# Altium schematic sheet Power.SchDoc
size C
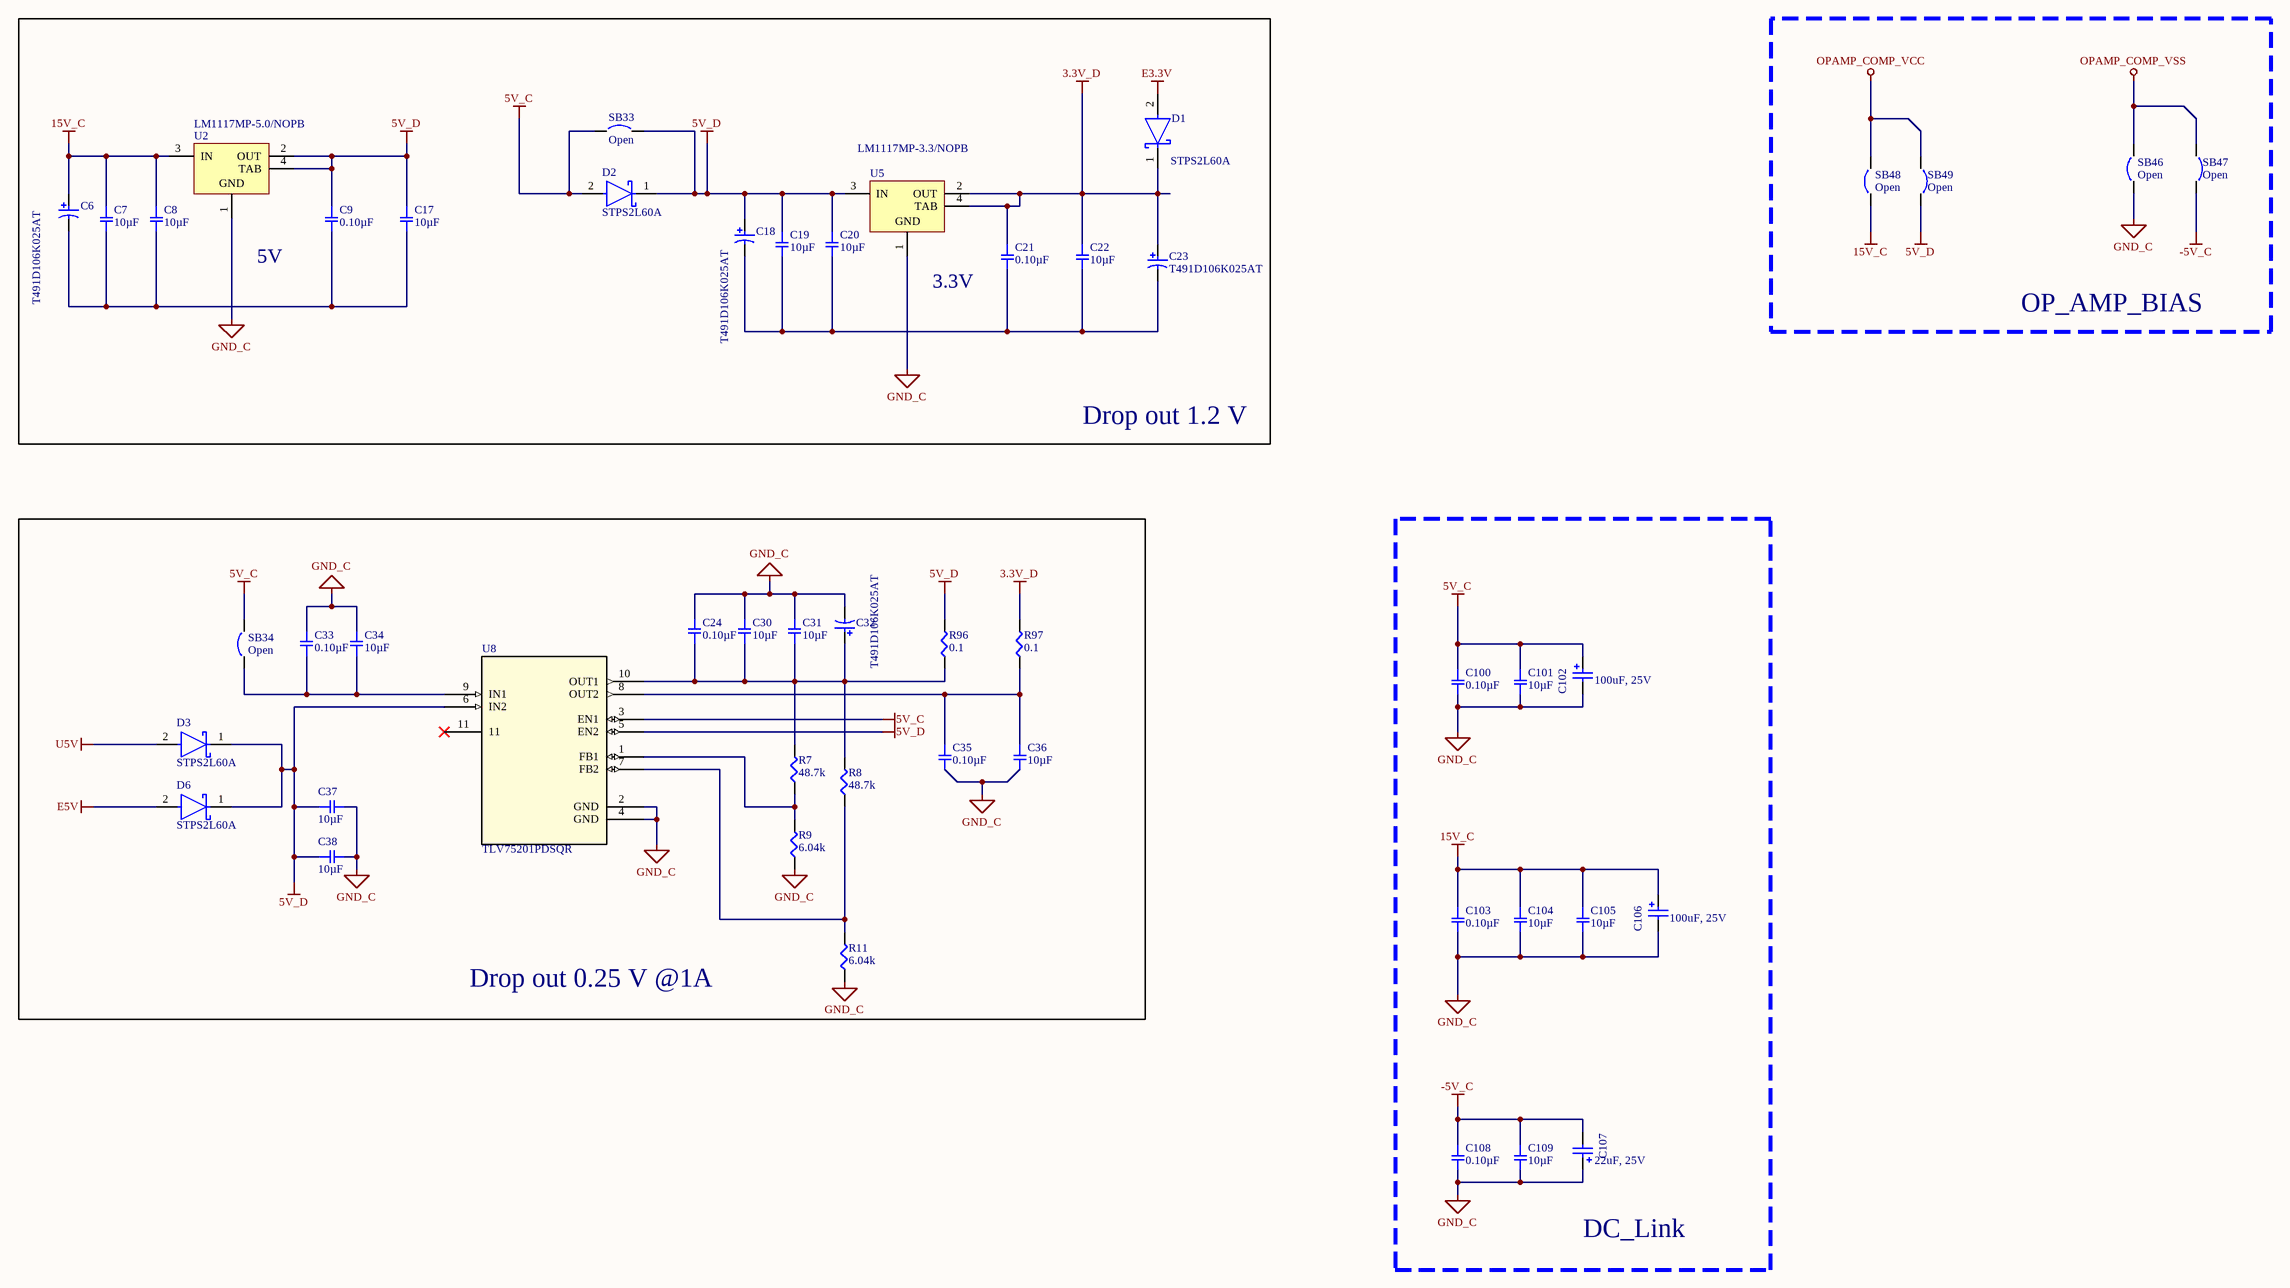
[diagram p0: Power.SchDoc]

## Parts
C6  T491D106K025AT  [KEMT-T491-D_L]
C7  10µF  [SMD-0805C]
C8  10µF  [SMD-0805C]
C9  0.10µF  [SMD-0805C]
C17  10µF  [SMD-0805C]
C18  T491D106K025AT  [KEMT-T491-D_L]
C19  10µF  [SMD-0805C]
C20  10µF  [SMD-0805C]
C21  0.10µF  [SMD-0805C]
C22  10µF  [SMD-0805C]
C23  T491D106K025AT  [KEMT-T491-D_L]
C24  0.10µF  [SMD-0805C]
C30  10µF  [SMD-0805C]
C31  10µF  [SMD-0805C]
C32  T491D106K025AT  [KEMT-T491-D_L]
C33  0.10µF  [SMD-0805C]
C34  10µF  [SMD-0805C]
C35  0.10µF  [SMD-0805C]
C36  10µF  [SMD-0805C]
C37  10µF  [SMD-0805C]
C38  10µF  [SMD-0805C]
C100  0.10µF  [SMD-0805C]
C101  10µF  [SMD-0805C]
C102  100uF, 25V  [WCAP-ASLU_6.3x7.7]
C103  0.10µF  [SMD-0805C]
C104  10µF  [SMD-0805C]
C105  10µF  [SMD-0805C]
C106  100uF, 25V  [WCAP-ASLU_6.3x7.7]
C107  22uF, 25V  [WCAP-ASLU_5x5.5]
C108  0.10µF  [SMD-0805C]
C109  10µF  [SMD-0805C]
D1  STPS2L60A  [FP-SMA-MFG]
D2  STPS2L60A  [FP-SMA-MFG]
D3  STPS2L60A  [FP-SMA-MFG]
D6  STPS2L60A  [FP-SMA-MFG]
R7  48.7k  [SMD-0603-RES]
R8  48.7k  [SMD-0603-RES]
R9  6.04k  [SMD-0603-RES]
R11  6.04k  [SMD-0603-RES]
R96  0.1  [SMD-1206-RES]
R97  0.1  [SMD-1206-RES]
SB33  Open  [SB_0603]  (no BOM)
SB34  Open  [SB_0603]  (no BOM)
SB46  Open  [Solder Bridge - HP]  (no BOM)
SB47  Open  [Solder Bridge - HP]  (no BOM)
SB48  Open  [Solder Bridge - HP]  (no BOM)
SB49  Open  [Solder Bridge - HP]  (no BOM)
U2  LM1117MP-5.0/NOPB  [DCY0004A_N]
U5  LM1117MP-3.3/NOPB  [DCY0004A_L]
U8  TLV75201PDSQR  [SON40P200X80_HS-11N]

## Blocks framed on the sheet
Drop out 1.2 V: C6-C9 C17-C23 D1 D2 SB33 U2 U5
OP_AMP_BIAS: SB46-SB49
Drop out 0.25 V @1A: C24 C30-C38 D3 D6 R7-R9 R11 R96 R97 SB34 U8
DC_Link: C100-C109

## Nets
3.3V_D: C21.1 C22.1 C23.1 D1.1(K) R97.2 U5.2(OUT) U5.4(TAB)
5V_C: C100.1 C101.1 C102.2(P) D2.2(A) SB33.1 SB34.2 U8.3(EN1)
5V_D: C9.1 C17.1 C18.1 C19.1 C20.1 C37.1 C38.1 D2.1(K) D3.1(K) D6.1(K) R96.2 SB33.2 SB49.1 U2.2(OUT) U2.4(TAB) U5.3(IN) U8.5(EN2) U8.6(IN2)
15V_C: C6.1 C7.1 C8.1 C103.1 C104.1 C105.1 C106.2(P) SB48.1 U2.3(IN)
-5V_C: C107.1(N) C108.1 C109.1 SB47.1
E3.3V: D1.2(A)
E5V: D6.2(A)
GND_C: C24.2 C30.2 C31.2 C32.2 C33.2 C34.2 C35.2 C36.2 C37.2 C38.2 C100.2 C101.2 C102.1(N) C103.2 C104.2 C105.2 C106.1(N) C107.2(P) C108.2 C109.2 R9.1 R11.1 SB46.1 U2.1(GND) U5.1(GND) U8.2(GND) U8.4(GND)
OPAMP_COMP_VCC: SB48.2 SB49.2
OPAMP_COMP_VSS: SB46.2 SB47.2
U5V: D3.2(A)
NetC6_2: C6.2 C7.2 C8.2 C9.2 C17.2
NetC18_2: C18.2 C19.2 C20.2 C21.2 C22.2 C23.2
NetC24_1: C24.1 C30.1 C31.1 C32.1 R7.2 R8.2 R96.1 U8.10(OUT1)
NetC33_1: C33.1 C34.1 SB34.1 U8.9(IN1)
NetC35_1: C35.1 C36.1 R97.1 U8.8(OUT2)
NetR7_1: R7.1 R9.2 U8.1(FB1)
NetR8_1: R8.1 R11.2 U8.7(FB2)

Not connected (* = marked no-connect by the designer): U8 11*

## Notes on the sheet
- 5V
- 3.3V

## Library data of the parts
C6 C18 C23 C32 = CMP-2000-07200-1: Tantalum Capacitor, 10 uF, +/- 10%, 25 V, -55 to 125 degC, 2-Pin SMD, RoHS, Tape and Reel; Manufacturer: Kemet; Insulation: NotRequired; Rad Hardened: No; Case Style: Molded; Polarity: Polar; Product Height (mm): 2.8mm; Capacitance: 10000000pF; Product Length (mm): 7.3mm; DF: 6%; ESR: 1ohm; Product Diameter (mm): NotRequiredmm; Voltage: 25VDC; Product Depth (mm): 4.3mm; DCL: 2.5uA; Mounting Style: SurfaceMount; Construction: SMTChip; Failure Rate: NotRequired; Operating Temp Range: -55Cto125C; Packaging: TapeandReel; Length W/Weld: NotRequiredmm; Package Reference: T491-D; Datasheet Version: 10/2016; Package / Case: 7343-31; Wire Form: NotRequired; Seated Plane Height: NotRequiredmm; Length W/Weld (max): NotRequiredmm; Package Description: 2-Pin Surface Mount Device, Body 7.3 x 4.3 mm; Tolerance (+ or -): 10%; Manufacturer URL: http://www.kemet.com/; Datasheet URL: http://capacitoredge.kemet.com/capedge2/DataSheet/Datasheet-T491D106K025AT.pdf?pn=T491D106K025AT; Case Code: D; Mounting Technology: SurfaceMount; Seal: NotRequired; Lead Spacing (nom): NotRequiredmm
C7 C8 C17 C19 C20 C22 C30 C31 C34 C36-C38 C101 C104 C105 C109 = GCM21BR71A106KE22L: CAP CER 10UF 10V X7R 0805; Manufacturer: Murata Electronics North America; Factory Stock: 0; Unit Price (USD): 0.49; Minimum Quantity: 1; Tolerance: ±10%; Datasheets: http://www.murata.com/~/media/webrenewal/support/library/catalog/products/capacitor/mlcc/c03e.ashx; Image: //media.digikey.com/photos/Murata%20Photos/NCP,GCM%20SERIES%200805.jpg; Digi-Key Part Number: 490-10674-1-ND; Part Number: GCM21BR71A106KE22L; Quantity Available: 125344; @ qty: 0; Packaging: Cut Tape (CT); Series: GCM; Part Status: Active; Value: 10µF; Voltage: 10V; Temperature Coefficient: X7R; Operating Temperature: -55°C ~ 125°C; Features: -; Ratings: AEC-Q200; Applications: Automotive; Mounting Type: Surface Mount, MLCC; Package / Case: 0805 (2012 Metric); Size / Dimension: 0.079" L x 0.049" W (2.00mm x 1.25mm); Height - Seated (Max): -; Thickness (Max): 0.055" (1.40mm); Lead Spacing: -; Lead Style: -
C9 C21 C24 C33 C35 C100 C103 C108 = GCJ21BR72A104KA01L: CAP CER 0.1UF 100V X7R 0805; Manufacturer: Murata Electronics North America; Factory Stock: 0; Unit Price (USD): 0.32; Minimum Quantity: 1; Tolerance: ±10%; Datasheets: http://www.murata.com/~/media/webrenewal/support/library/catalog/products/capacitor/mlcc/c03e.ashx; Image: //media.digikey.com/Renders/Murata%20Renders/0805%20(2012%20Metric)%20.85mm.jpg; Digi-Key Part Number: 490-5825-1-ND; Part Number: GCJ21BR72A104KA01L; Quantity Available: 1873; @ qty: 0; Packaging: Cut Tape (CT); Series: GCJ; Part Status: Active; Value: 0.10µF; Voltage: 100V; Temperature Coefficient: X7R; Operating Temperature: -55°C ~ 125°C; Features: Soft Termination; Ratings: AEC-Q200; Applications: Automotive, Boardflex Sensitive; Mounting Type: Surface Mount, MLCC; Package / Case: 0805 (2012 Metric); Size / Dimension: 0.079" L x 0.049" W (2.00mm x 1.25mm); Height - Seated (Max): -; Thickness (Max): 0.049" (1.25mm); Lead Spacing: -; Lead Style: -
C102 C106 = 865090445008: WCAP-ASLU Aluminium Electrolytic Capacitors, D6.3mm x L7.7mm, 100uF, +/-20%, 25VDC; Dissipation Factor: 16%; Leakage Current: 5uA; Endurance: 1000h; Technical Reference: ASBD077101M025DVCTCA000; Ripple Current max.: 102mA; ComponentLink1Description: Manufacturer; ComponentLink1URL: http://www.we-online.de; ComponentLink2Description: Datasheet; ComponentLink2URL: https://katalog.we-online.com/pbs/datasheet/865090445008.pdf; Mounting Technology: SMD; Operating Temperature: -40 to +85degC; Packaging: Tape and Reel; Part Number: 865090445008; Publisher: Wurth Elektronik; Capacitance: 100uF; Diameter: 6.3mm; Length: 7.7mm; Published Date: August 2019; Rated Voltage: 25VDC; Capacitance Tolerance: +/-20%
C107 = 865090442004: WCAP-ASLU Aluminium Electrolytic Capacitors, D5mm x L5.5mm, 22uF, +/-20%, 25VDC; Dissipation Factor: 16%; Leakage Current: 1.1uA; Endurance: 1000h; Technical Reference: ASBC055220M025DVCTBA000; Ripple Current max.: 42mA; ComponentLink1Description: Manufacturer; ComponentLink1URL: http://www.we-online.de; ComponentLink2Description: Datasheet; ComponentLink2URL: https://katalog.we-online.com/pbs/datasheet/865090442004.pdf; Mounting Technology: SMD; Operating Temperature: -40 to +85degC; Packaging: Tape and Reel; Part Number: 865090442004; Publisher: Wurth Elektronik; Capacitance: 22uF; Diameter: 5mm; Length: 5.5mm; Published Date: August 2019; Rated Voltage: 25VDC; Capacitance Tolerance: +/-20%
D1-D3 D6 = CMP-12187-000014-1: DIODE SCHOTTKY 60V 2A SMA; Manufacturer: STMicroelectronics; Peak Reverse Current: 100uA; Max Junction Temp: +150°C; Max Surge Forward Current: 75A; Standoff Height: 0.05mm; Octopart: https://octopart.com/stps2l60a-stmicroelectronics-324283; Manufacturer Part Number: STPS2L60A; Package: SMA; Temperature Range High: +150°C; Lead Free: Yes; Digikey Description: DIODE SCHOTTKY 60V 2A SMA; Height: 2.65mm; Device Class L3: Schottky Diodes; RoHS: TRUE; ComponentLink2URL: https://www.st.com/resource/en/datasheet/stps2l60.pdf; Automotive: No; Max Repetitive Reverse Voltage: 60V; Device Class L1: Discrete Semiconductors; Category: Diode; ComponentLink2Description: Datasheet; Device Class L2: Diodes; Forward Current: 2A; Temperature: to +150°C; Mouser Description: Schottky diode Configuration: Single Housing type: DO-214AC=SMA Peak conducting-state current: 75 A
R7 R8 = ERJ-3EKF4872V: RES SMD 48.7K OHM 1% 1/10W 0603; Manufacturer: Panasonic Electronic Components; Factory Stock: 0; Unit Price (USD): 0.00379; @ qty: 1500; Minimum Quantity: 1; Power (Watts): 0.1W, 1/10W; Temperature Coefficient: ±100ppm/°C; Part Number: ERJ-3EKF4872V; Datasheets: http://industrial.panasonic.com/www-cgi/jvcr13pz.cgi?E+PZ+3+AOA0002+ERJ3EKF4872V+7+WW; Image: //media.digikey.com/Photos/Panasonic%20Photos/MFG_ERJ-P6W%20Series.jpg; Digi-Key Part Number: P48.7KHCT-ND; Quantity Available: 117361; Packaging: Cut Tape (CT); Series: ERJ; Part Status: Active; Value: 48.7k; Tolerance: ±1%; Composition: Thick Film; Features: Automotive AEC-Q200; Operating Temperature: -55°C ~ 155°C; Package / Case: 0603 (1608 Metric); Supplier Device Package: 0603; Size / Dimension: 0.063" L x 0.031" W (1.60mm x 0.80mm); Height - Seated (Max): 0.022" (0.55mm); Number of Terminations: 2; Failure Rate: -
R9 R11 = ERJ-3EKF6041V: RES SMD 6.04K OHM 1% 1/10W 0603; Manufacturer: Panasonic Electronic Components; Factory Stock: 0; Unit Price (USD): 0.00379; @ qty: 1500; Minimum Quantity: 1; Power (Watts): 0.1W, 1/10W; Temperature Coefficient: ±100ppm/°C; Part Number: ERJ-3EKF6041V; Datasheets: http://industrial.panasonic.com/www-cgi/jvcr13pz.cgi?E+PZ+3+AOA0002+ERJ3EKF6041V+7+WW; Image: //media.digikey.com/Photos/Panasonic%20Photos/MFG_ERJ-P6W%20Series.jpg; Digi-Key Part Number: P6.04KHCT-ND; Quantity Available: 391545; Packaging: Cut Tape (CT); Series: ERJ; Part Status: Active; Value: 6.04k; Tolerance: ±1%; Composition: Thick Film; Features: Automotive AEC-Q200; Operating Temperature: -55°C ~ 155°C; Package / Case: 0603 (1608 Metric); Supplier Device Package: 0603; Size / Dimension: 0.063" L x 0.031" W (1.60mm x 0.80mm); Height - Seated (Max): 0.022" (0.55mm); Number of Terminations: 2; Failure Rate: -
R96 R97 = ERJ-8BSFR10V: RES SMD 0.1 OHM 1% 1/2W 1206; Manufacturer: Panasonic Electronic Components; Factory Stock: 0; Unit Price (USD): 0.11739; @ qty: 1500; Minimum Quantity: 1; Power (Watts): 0.5W, 1/2W; Temperature Coefficient: ±250ppm/°C; Part Number: ERJ-8BSFR10V; Datasheets: https://industrial.panasonic.com/cdbs/www-data/pdf/RDA0000/AOA0000C239.pdf; Image: //media.digikey.com/Renders/Panasonic%20Renders/ERJ-1206%20Pkg.jpg; Digi-Key Part Number: P17678CT-ND; Quantity Available: 5524; Packaging: Cut Tape (CT); Series: ERJ; Part Status: Active; Value: 0.1; Tolerance: ±1%; Composition: Thick Film; Features: Automotive AEC-Q200, Current Sense; Operating Temperature: -55°C ~ 125°C; Package / Case: 1206 (3216 Metric); Supplier Device Package: 1206; Size / Dimension: 0.126" L x 0.063" W (3.20mm x 1.60mm); Height - Seated (Max): 0.028" (0.70mm); Number of Terminations: 2; Failure Rate: -
SB33 SB34 SB46-SB49 = Solder Bridge: Circuit Breaker; Published: 24-Mar-1999; Revision: July-2002: Re-released for DXP Platform.; Publisher: Altium Limited
U2 = CMP-0062-01634-4: 800mA Low-Dropout Linear Regulator, 4-pin SOT-223, Pb-Free; Manufacturer: Texas Instruments; PowerWise: N; PackageTopMarking: XYTT*N06A; CompType: LDO IC; High-Reliability: Y; Code_JEDEC: TO-261-AA; ComponentLink1Description: Datasheet URL; ComponentLink1URL: http://www.ti.com/general/docs/lit/getliterature.tsp?genericPartNumber=LM1117-N&fileType=pdf; PackageReference: DCY0004A; PartNumber: LM1117MP-5.0/NOPB; PackageDescription: Molded SOT-223, 6.50 x 3.56 x 1.6mm Body, 4 Lead, 2.3mm Pitch; RoHS: Y; Code_IPC: SOT223-4; PinCount: 4
U5 = CMP-0062-01638-4: 800mA Low-Dropout Linear Regulator, 4-pin SOT-223, Pb-Free; Manufacturer: Texas Instruments; CompType: LDO IC; PackageTopMarking: XYTT*N05A; High-Reliability: Y; PowerWise: N; ComponentLink1URL: http://www.ti.com/general/docs/lit/getliterature.tsp?genericPartNumber=LM1117-N&fileType=pdf; PinCount: 4; PackageDescription: Molded SOT-223, 6.50 x 3.56 x 1.6mm Body, 4 Lead, 2.3mm Pitch; Code_IPC: SOT223-4; PartNumber: LM1117MP-3.3/NOPB; Code_JEDEC: TO-261-AA; RoHS: Y; PackageReference: DCY0004A; ComponentLink1Description: Datasheet URL
U8 = TLV75201PDSQR: No Description Available; SourceLibrary: TI_2020-07-28; Vendor: Texas Instruments; Built_By: EMA_Matt; Datasheet: https://www.ti.com/lit/ds/symlink/tlv752.pdf; Manufacturer_Part_Number: TLV75201PDSQR; Copyright: Copyright (C) 2018 Accelerated Designs. All rights reserved; RefDes: RefDes; Type: DEV